# Altium schematic sheet sensor-bank.SchDoc
size A4; DocumentNumber: 6; SheetNumber: 6; SheetTotal: 8
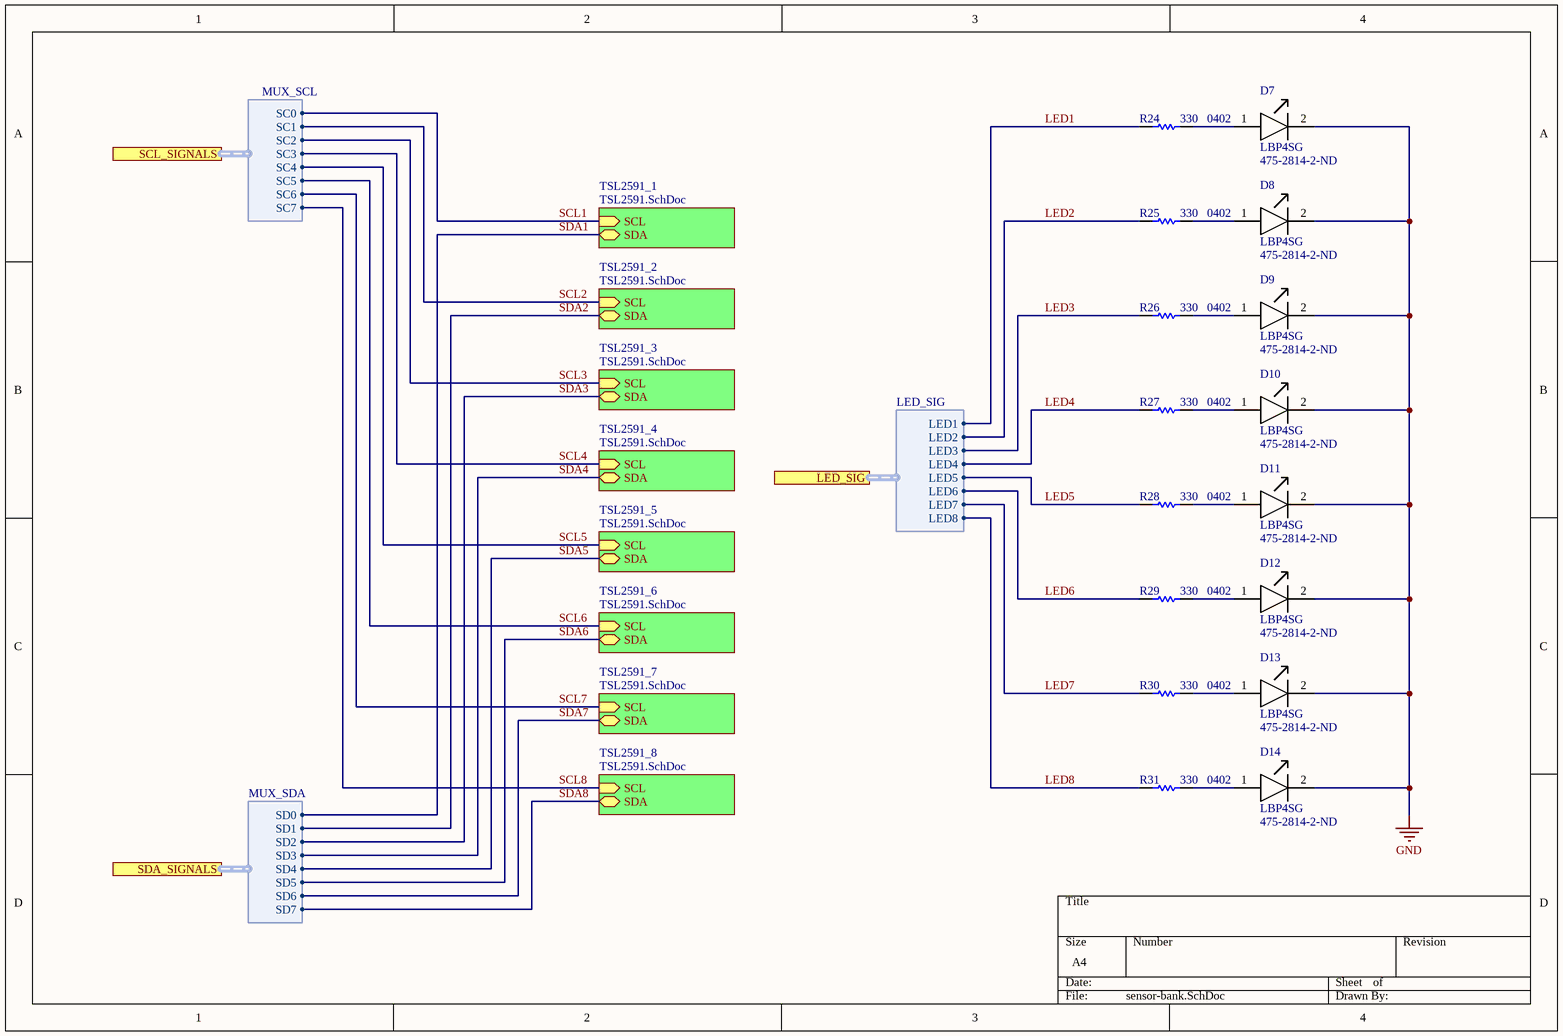
[diagram p0: sensor-bank.SchDoc]

## Parts
D7  LBP4SG  Supplier Part Number 1: 475-2814-2-ND  [LB P4SG]
D8  LBP4SG  Supplier Part Number 1: 475-2814-2-ND  [LB P4SG]
D9  LBP4SG  Supplier Part Number 1: 475-2814-2-ND  [LB P4SG]
D10  LBP4SG  Supplier Part Number 1: 475-2814-2-ND  [LB P4SG]
D11  LBP4SG  Supplier Part Number 1: 475-2814-2-ND  [LB P4SG]
D12  LBP4SG  Supplier Part Number 1: 475-2814-2-ND  [LB P4SG]
D13  LBP4SG  Supplier Part Number 1: 475-2814-2-ND  [LB P4SG]
D14  LBP4SG  Supplier Part Number 1: 475-2814-2-ND  [LB P4SG]
R24  0402  value 330  [AXIAL-0.3]
R25  0402  value 330  [AXIAL-0.3]
R26  0402  value 330  [AXIAL-0.3]
R27  0402  value 330  [AXIAL-0.3]
R28  0402  value 330  [AXIAL-0.3]
R29  0402  value 330  [AXIAL-0.3]
R30  0402  value 330  [AXIAL-0.3]
R31  0402  value 330  [AXIAL-0.3]

## Sub-sheets
TSL2591_1 = TSL2591.SchDoc: SCL (in), SDA (bidir)
TSL2591_2 = TSL2591.SchDoc: SCL (in), SDA (bidir)
TSL2591_3 = TSL2591.SchDoc: SCL (in), SDA (bidir)
TSL2591_4 = TSL2591.SchDoc: SCL (in), SDA (bidir)
TSL2591_5 = TSL2591.SchDoc: SCL (in), SDA (bidir)
TSL2591_6 = TSL2591.SchDoc: SCL (in), SDA (bidir)
TSL2591_7 = TSL2591.SchDoc: SCL (in), SDA (bidir)
TSL2591_8 = TSL2591.SchDoc: SCL (in), SDA (bidir)

## Ports
LED_SIG (harness LED_SIG), SCL_SIGNALS (harness MUX_SCL), SDA_SIGNALS (harness MUX_SDA)

## Harnesses
LED_SIG: LED1, LED2, LED3, LED4, LED5, LED6, LED7, LED8
MUX_SDA: SD0, SD1, SD2, SD3, SD4, SD5, SD6, SD7
MUX_SCL: SC0, SC1, SC2, SC3, SC4, SC5, SC6, SC7

## Nets
GND: D7.2(Cathode) D8.2(Cathode) D9.2(Cathode) D10.2(Cathode) D11.2(Cathode) D12.2(Cathode) D13.2(Cathode) D14.2(Cathode)
LED1: R24.1 ; port LED_SIG.LED1
LED2: R25.1 ; port LED_SIG.LED2
LED3: R26.1 ; port LED_SIG.LED3
LED4: R27.1 ; port LED_SIG.LED4
LED5: R28.1 ; port LED_SIG.LED5
LED6: R29.1 ; port LED_SIG.LED6
LED7: R30.1 ; port LED_SIG.LED7
LED8: R31.1 ; port LED_SIG.LED8
SCL1: sheet TSL2591_1/SCL, port SCL_SIGNALS.SC0
SCL2: sheet TSL2591_2/SCL, port SCL_SIGNALS.SC1
SCL3: sheet TSL2591_3/SCL, port SCL_SIGNALS.SC2
SCL4: sheet TSL2591_4/SCL, port SCL_SIGNALS.SC3
SCL5: sheet TSL2591_5/SCL, port SCL_SIGNALS.SC4
SCL6: sheet TSL2591_6/SCL, port SCL_SIGNALS.SC5
SCL7: sheet TSL2591_7/SCL, port SCL_SIGNALS.SC6
SCL8: sheet TSL2591_8/SCL, port SCL_SIGNALS.SC7
SDA1: sheet TSL2591_1/SDA, port SDA_SIGNALS.SD0
SDA2: sheet TSL2591_2/SDA, port SDA_SIGNALS.SD1
SDA3: sheet TSL2591_3/SDA, port SDA_SIGNALS.SD2
SDA4: sheet TSL2591_4/SDA, port SDA_SIGNALS.SD3
SDA5: sheet TSL2591_5/SDA, port SDA_SIGNALS.SD4
SDA6: sheet TSL2591_6/SDA, port SDA_SIGNALS.SD5
SDA7: sheet TSL2591_7/SDA, port SDA_SIGNALS.SD6
SDA8: sheet TSL2591_8/SDA, port SDA_SIGNALS.SD7
NetD7_1: D7.1(Anode) R24.2
NetD8_1: D8.1(Anode) R25.2
NetD9_1: D9.1(Anode) R26.2
NetD10_1: D10.1(Anode) R27.2
NetD11_1: D11.1(Anode) R28.2
NetD12_1: D12.1(Anode) R29.2
NetD13_1: D13.1(Anode) R30.2
NetD14_1: D14.1(Anode) R31.2

## Library data of the parts
D7-D14 = LB P4SG: LED BLUE CLEAR SMD BOTTOM ENTRY; Supplier 1: Digi-Key
R24-R31 = Res1: Resistor; Published: 8-Jun-2000; LatestRevisionDate: 17-Jul-2002; LatestRevisionNote: Re-released for DXP Platform.; PackageReference: AXIAL-0.3; Publisher: Altium Limited; PackageDescription: Axial Device, Thru-Hole; 2 Leads; 0.3 in Pin Spacing